# EAGLE design Argos_Battery_Charge_Monitor_HAT (EAGLE 8.4.2)
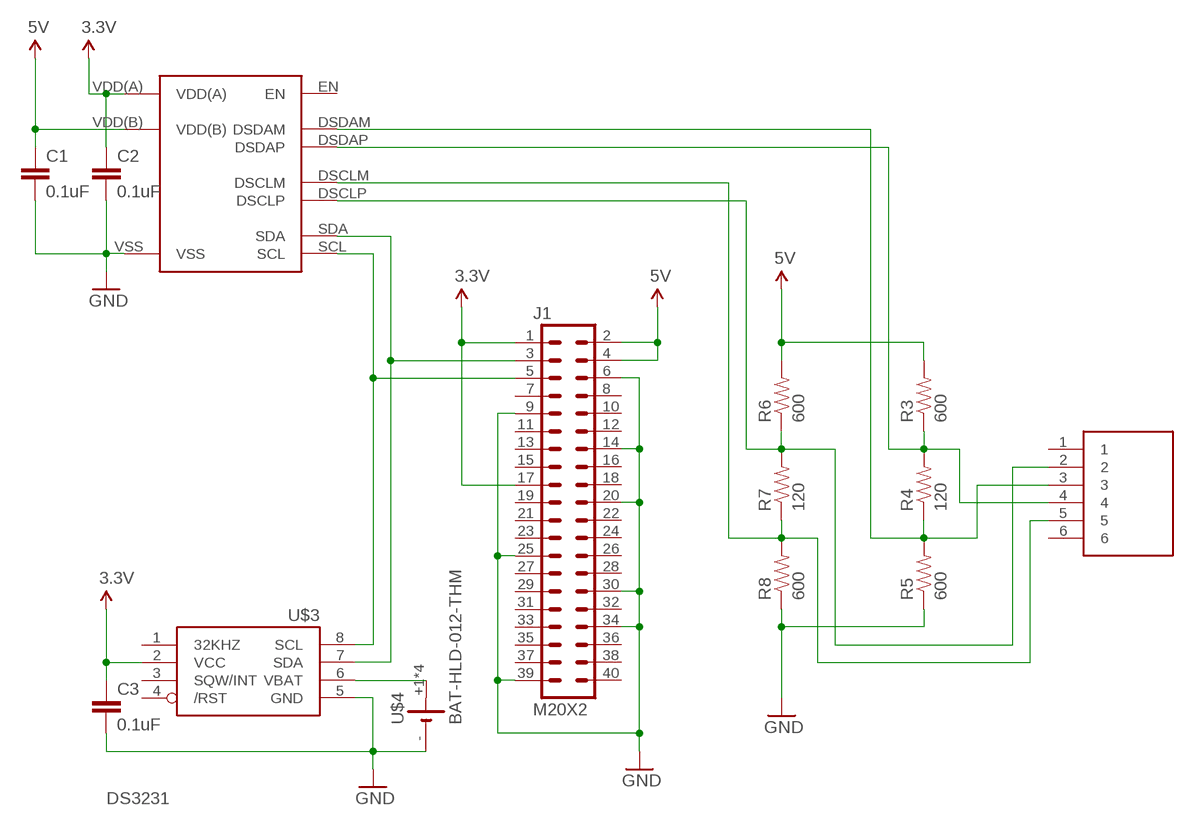
[diagram p0: schematic, sheet 1]

## Parts
C1  0.1uF  CAP0805  [0805]
C2  0.1uF  CAP0805  [0805]
C3  0.1uF  CAP0805  [0805]
J1  M20X2  [2X20]
R3  600  RESISTOR0805-RES  [0805]
R4  120  RESISTOR0805-RES  [0805]
R5  600  RESISTOR0805-RES  [0805]
R6  600  RESISTOR0805-RES  [0805]
R7  120  RESISTOR0805-RES  [0805]
R8  600  RESISTOR0805-RES  [0805]
U$1  E5566-Q0LK22-L  [E5566-Q0LK22-L]
U$2  SOP50P490X110-10N  [SOP50P490X110-10N]
U$3  DS3231MZ  [SOIC8]
U$4  BAT-HLD-012-THM  [BAT-HLD-012-THM]

## Nets
3.3V: C2.1 C3.1 J1.1 J1.17 U$2.VDD(A) U$3.2(VCC)
5V: C1.1 J1.2 J1.4 R3.2 R6.2 U$2.VDD(B)
D_SCL_M: R7.1 R8.2 U$1.5 U$2.DSCLM
D_SCL_P: R6.1 R7.2 U$1.2 U$2.DSCLP
D_SDA_M: R4.1 R5.2 U$1.3 U$2.DSDAM
D_SDA_P: R3.1 R4.2 U$1.4 U$2.DSDAP
GND: C1.2 C2.2 C3.2 J1.6 J1.9 J1.14 J1.20 J1.25 J1.30 J1.34 J1.39 R5.1 R8.1 U$2.VSS U$3.5(GND) U$4.-
N$7: U$3.6(VBAT) U$4.+1(+) U$4.+2(+) U$4.+3(+) U$4.+4(+)
SCL: J1.5 U$2.SCL U$3.8(SCL)
SDA: J1.3 U$2.SDA U$3.7(SDA)
Unconnected: J1.7 J1.8 J1.10 J1.11 J1.12 J1.13 J1.15 J1.16 J1.18 J1.19 J1.21 J1.22 J1.23 J1.24 J1.26 J1.27 J1.28 J1.29 J1.31 J1.32 J1.33 J1.35 J1.36 J1.37 J1.38 J1.40 U$1.1 U$1.6 U$2.EN U$3.1(32KHZ) U$3.3(SQW/INT) U$3.4(/RST)

## Library data of the parts
C1-C3 = SparkFun-Capacitors:CAP: Capacitor Standard 0603 ceramic capacitor, and 0.1" leaded capacitor.
J1 = SparkFun-Connectors:M20X2: 0.1" spaced headers
R3-R8 = SparkFun-Resistors:RESISTOR: Resistor Basic schematic elements and footprints for 0603, 1206, and PTH resistors.
U$1 = E5566-Q0LK22-L:E5566-Q0LK22-L
U$2 = SOP50P490X110-10N:SOP50P490X110-10N
U$3 = DS3231MZ:DS3231MZ
U$4 = BAT-HLD-012-THM:BAT-HLD-012-THM

## Board
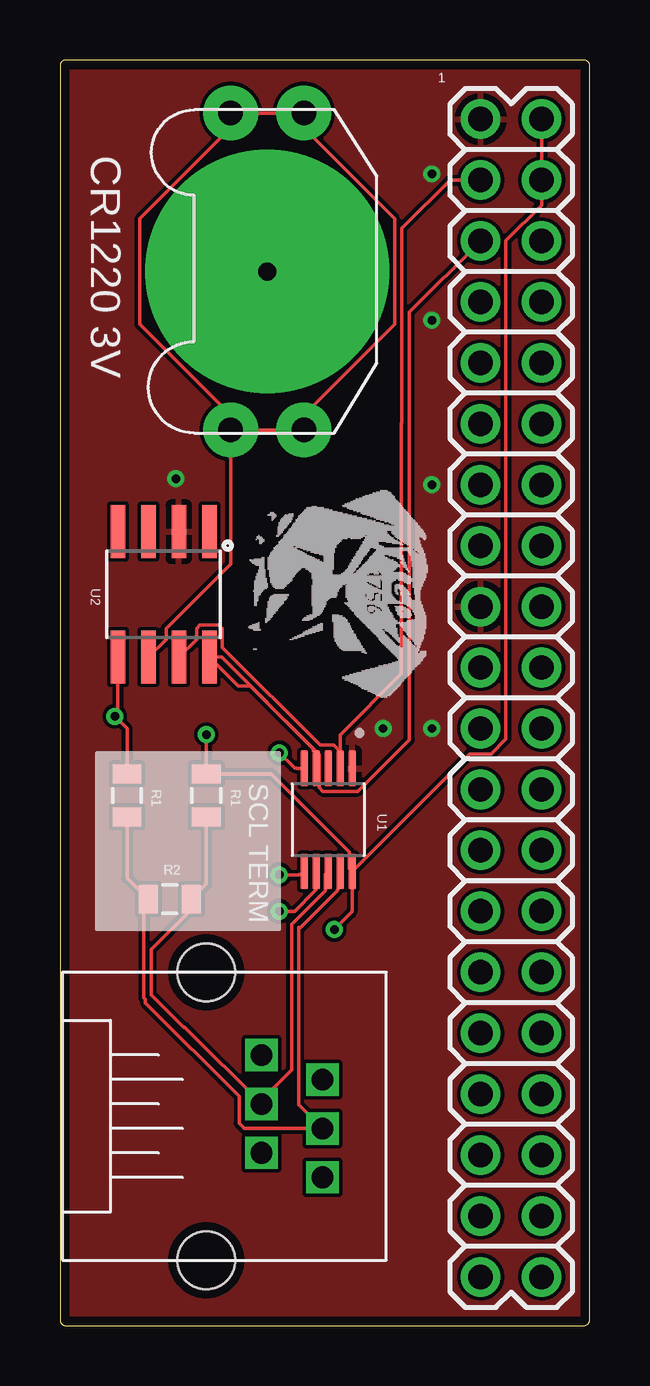
[diagram p1: board, top side]
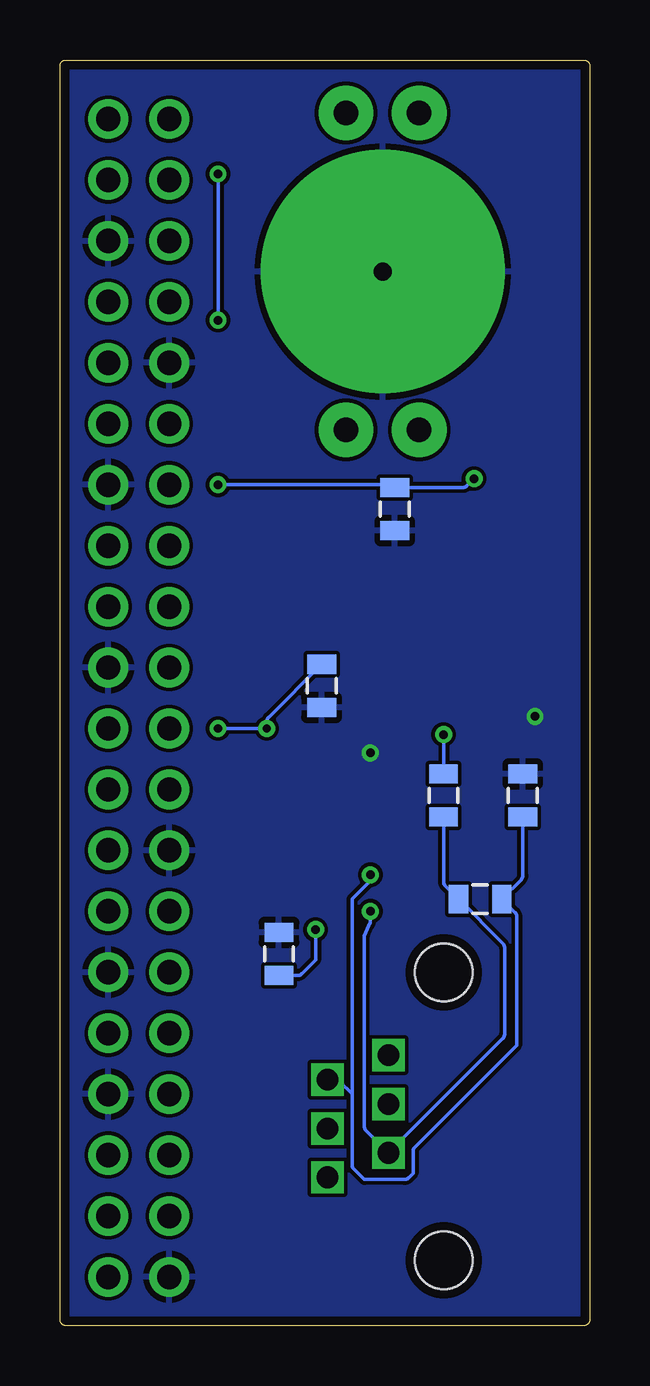
[diagram p2: board, bottom side, seen from below]

Size 22.08 x 52.76 mm. Coordinates in mm from the lower left corner, seen from the top.
Outline: 21.82,52.76 0.25,52.76 arc90 0,52.5 0,0.25 arc90 0.25,0 21.82,0 arc90 22.08,0.25 22.08,52.5 arc90 21.82,52.76
Copper layers (1*16): Top 0.0356mm / dielectric 1.5011mm / Bottom 0.0356mm
Design rules "LaenPCBOrder": minimum track width 6mil, minimum drill 13mil, track to track 6mil, track to pad 6mil, pad to pad 6mil, via to via 6mil, smd to smd 6mil, copper to edge 15mil, drill to drill 6mil, minimum pad ring 7mil, minimum via ring 7mil, stop-mask expansion 3mil, vias tented up to drill 0mil, thermal gap 10mil

### Footprints (pad centres in the part's own frame; a part is rotated, then mirrored left to right if it is on the bottom)
0805 = smd 0.8 x 1.2: 1 -0.9,0; 2 0.9,0
2X20 = drill 1.016 pad 1.651: 1 -24.13,-1.27; 2 -24.13,1.27; 3 -21.59,-1.27; 4 -21.59,1.27; 5 -19.05,-1.27; 6 -19.05,1.27; 7 -16.51,-1.27; 8 -16.51,1.27; 9 -13.97,-1.27; 10 -13.97,1.27; 11 -11.43,-1.27; 12 -11.43,1.27; 13 -8.89,-1.27; 14 -8.89,1.27; 15 -6.35,-1.27; 16 -6.35,1.27; 17 -3.81,-1.27; 18 -3.81,1.27; 19 -1.27,-1.27; 20 -1.27,1.27; 21 1.27,-1.27; 22 1.27,1.27; 23 3.81,-1.27; 24 3.81,1.27; 25 6.35,-1.27; 26 6.35,1.27; 27 8.89,-1.27; 28 8.89,1.27; 29 11.43,-1.27; 30 11.43,1.27; 31 13.97,-1.27; 32 13.97,1.27; 33 16.51,-1.27; 34 16.51,1.27; 35 19.05,-1.27; 36 19.05,1.27; 37 21.59,-1.27; 38 21.59,1.27; 39 24.13,-1.27; 40 24.13,1.27
E5566-Q0LK22-L = drill 0.9 square: 1 8.55,4.84; 2 7.53,2.3; 3 6.51,4.84; 4 5.49,2.3; 5 4.47,4.84; 6 3.45,2.3 | hole 2.4: 0,0; 12,0
SOP50P490X110-10N = smd 1.47 x 0.31: DSCLM 2.15,-1; DSCLP 2.15,-0.5; DSDAM 2.15,0.5; DSDAP 2.15,0; EN -2.15,0; SCL -2.15,-0.5; SDA -2.15,0.5; VDD(A) -2.15,1; VDD(B) 2.15,1; VSS -2.15,-1
SOIC8 = smd 0.61 x 2.21: 1 -1.905,-2.616; 2 -0.635,-2.616; 3 0.635,-2.616; 4 1.905,-2.616; 5 1.905,2.616; 6 0.635,2.616; 7 -0.635,2.616; 8 -1.905,2.616
BAT-HLD-012-THM = drill 1.016 pad 2.286: +1 -6.604,1.524; +2 6.604,1.524; +3 -6.604,-1.524; +4 6.604,-1.524 | drill 0.75 pad 10.16: - 0,0

### Placement (x,y rotation side)
C1  12.95,15.49 90 bottom
C2  8.13,34.04 270 bottom
C3  11.18,26.67 270 bottom
J1  18.8,26.16 270 top
R3  6.1,22.1 90 top
R4  4.57,17.78 0 top
R5  2.79,22.1 270 top
R6  6.1,22.1 90 bottom
R7  4.57,17.78 180 bottom
R8  2.79,22.1 270 bottom
U$1  6.1,14.73 270 top
U$2  11.18,21.08 270 top
U$3  4.32,30.48 180 top
U$4  8.64,43.94 90 top

### Tracks (layer width: path | path; a pad name or v marks a point on that pad's centre or on a via)
3.3V  (via drill 0.35)
  Bottom 0.152: C3.1 13.39,25.36 arc-45 13.46,25.18 v13.46,24.89 v15.49,24.89 | v15.49,35.05 8.35,35.05 arc45 8.17,34.98 C2.1 5.3,34.94 arc-45 5.12,35.01 v4.83,35.31 | v15.49,48.01 v15.49,41.91
  pour Top: 0,52.83 22.1,52.83 22.1,0 0,0
5V  (via drill 0.35)
  Top 0.152: J1.2 J1.4 20.07,46.7 18.58,45.22 18.58,24.45 17.96,23.84 17.08,23.84 U$2.VDD(B) | U$2.VDD(B) 12.06,19.05 12.06,19.74 8.8,23 R3.2 v6.1,24.64 | U$2.VDD(B) 12.18,17.36 arc-45 12.1,17.18 v11.43,16.51
  Bottom 0.152: v6.1,24.64 R3.2 | v11.43,16.51 11.43,15.24 12,14.67 arc45 12.18,14.59 C1.1
D_SCL_M  (via drill 0.35)
  Top 0.152: v9.14,18.8 9.94,18.8 arc45 10.11,18.87 U$2.DSCLM
  Bottom 0.152: R8.2 2.79,18.76 arc45 2.87,18.58 R7.1 3.12,17.23 arc45 3.05,17.05 3.05,11.68 7.29,7.44 arc-45 7.37,7.26 7.37,6.35 7.55,6.17 arc45 7.72,6.1 9.4,6.1 9.83,6.53 arc45 9.91,6.71 9.91,9.65 | 9.91,9.65 10.44,10.19 arc-45 10.62,10.26 U$1.5 | v9.14,18.8 9.14,18.65 arc45 9.22,18.47 9.91,17.78 9.91,9.65
D_SCL_P  (via drill 0.35)
  Top 0.152: v9.14,17.27 9.78,17.27 10.6,18.1 arc45 10.68,18.28 U$2.DSCLP
  Bottom 0.152: R6.1 6.1,18.51 arc-45 6.02,18.33 R7.2 3.63,15.94 arc45 3.56,15.76 3.56,12.15 arc45 3.63,11.97 U$1.2 9.32,8.13 arc45 9.4,8.31 9.4,16.26 9.22,16.69 arc-45 9.14,16.87 v9.14,17.27
D_SDA_M
  Top 0.152: U$2.DSDAM 11.68,18.29 11.56,18.16 11.56,18.12 10.03,16.59 9.96,16.59 9.96,9.2 U$1.3 7.68,8.22 7.46,8.44 7.46,9.55 3.56,13.46 3.56,13.6 3.5,13.66 3.5,17.61 R4.1 2.79,18.66 R5.2
D_SDA_P
  Top 0.152: U$2.DSDAP 11.06,18.82 11.06,18.12 9.65,16.72 9.65,10.67 8.4,9.41 U$1.4 5.2,12.44 5.15,12.44 3.8,13.78 3.8,15.68 5.47,17.35 R4.2 6.1,18.4 R3.1
GND  (via drill 0.35)
  Top 0.152: U$3.5 2.41,25.53 v2.29,25.4 2.79,24.89 R5.1 | v9.14,23.88 9.71,23.31 arc45 9.89,23.23 U$2.VSS
  pour Bottom: 0,52.83 0,0 44.45,0 44.45,52.58 44.45,52.83
N$7
  Top 0.152: U$4.+1 U$4.+3 10.16,37.96 13.95,41.74 13.95,46.14 10.16,49.92 U$4.+4 U$4.+2 7.11,49.92 3.33,46.14 3.33,41.74 7.11,37.96 U$4.+1 | U$3.6 4.42,28.6 4.42,29.06 7.11,31.76 U$4.+1
SCL
  Top 0.152: U$2.SCL 10.68,23.87 10.56,23.98 10.56,24.04 6.74,27.86 U$3.8 7.42,26.66 7.93,26.66 10.79,23.81 10.79,22.43 10.95,22.27 12.4,22.27 14.55,24.42 14.55,42.24 J1.5
SDA
  Top 0.152: U$3.7 5.69,28.6 5.69,29.06 5.82,29.2 6.62,29.2 6.76,29.06 6.76,28.27 10.83,24.2 11.4,24.2 11.68,23.92 U$2.SDA 11.68,24.63 14.22,27.18 14.22,37.6 14.25,37.62 14.25,45.74 16.26,47.75 J1.3

### Text on the board
_tsilk: 1 | CR1220 3V | U2 | SCL TERM | R1 | R1 | U1 | R2
_bsilk: Argos Battery Charge Monitor / HAT Rev 2017A | C1 | C1 | R1 | R1 | R2 | SDA TERM | C1